# EAGLE design Netzteil_Darlington_v2_Frontpanel (EAGLE 8.6.3)
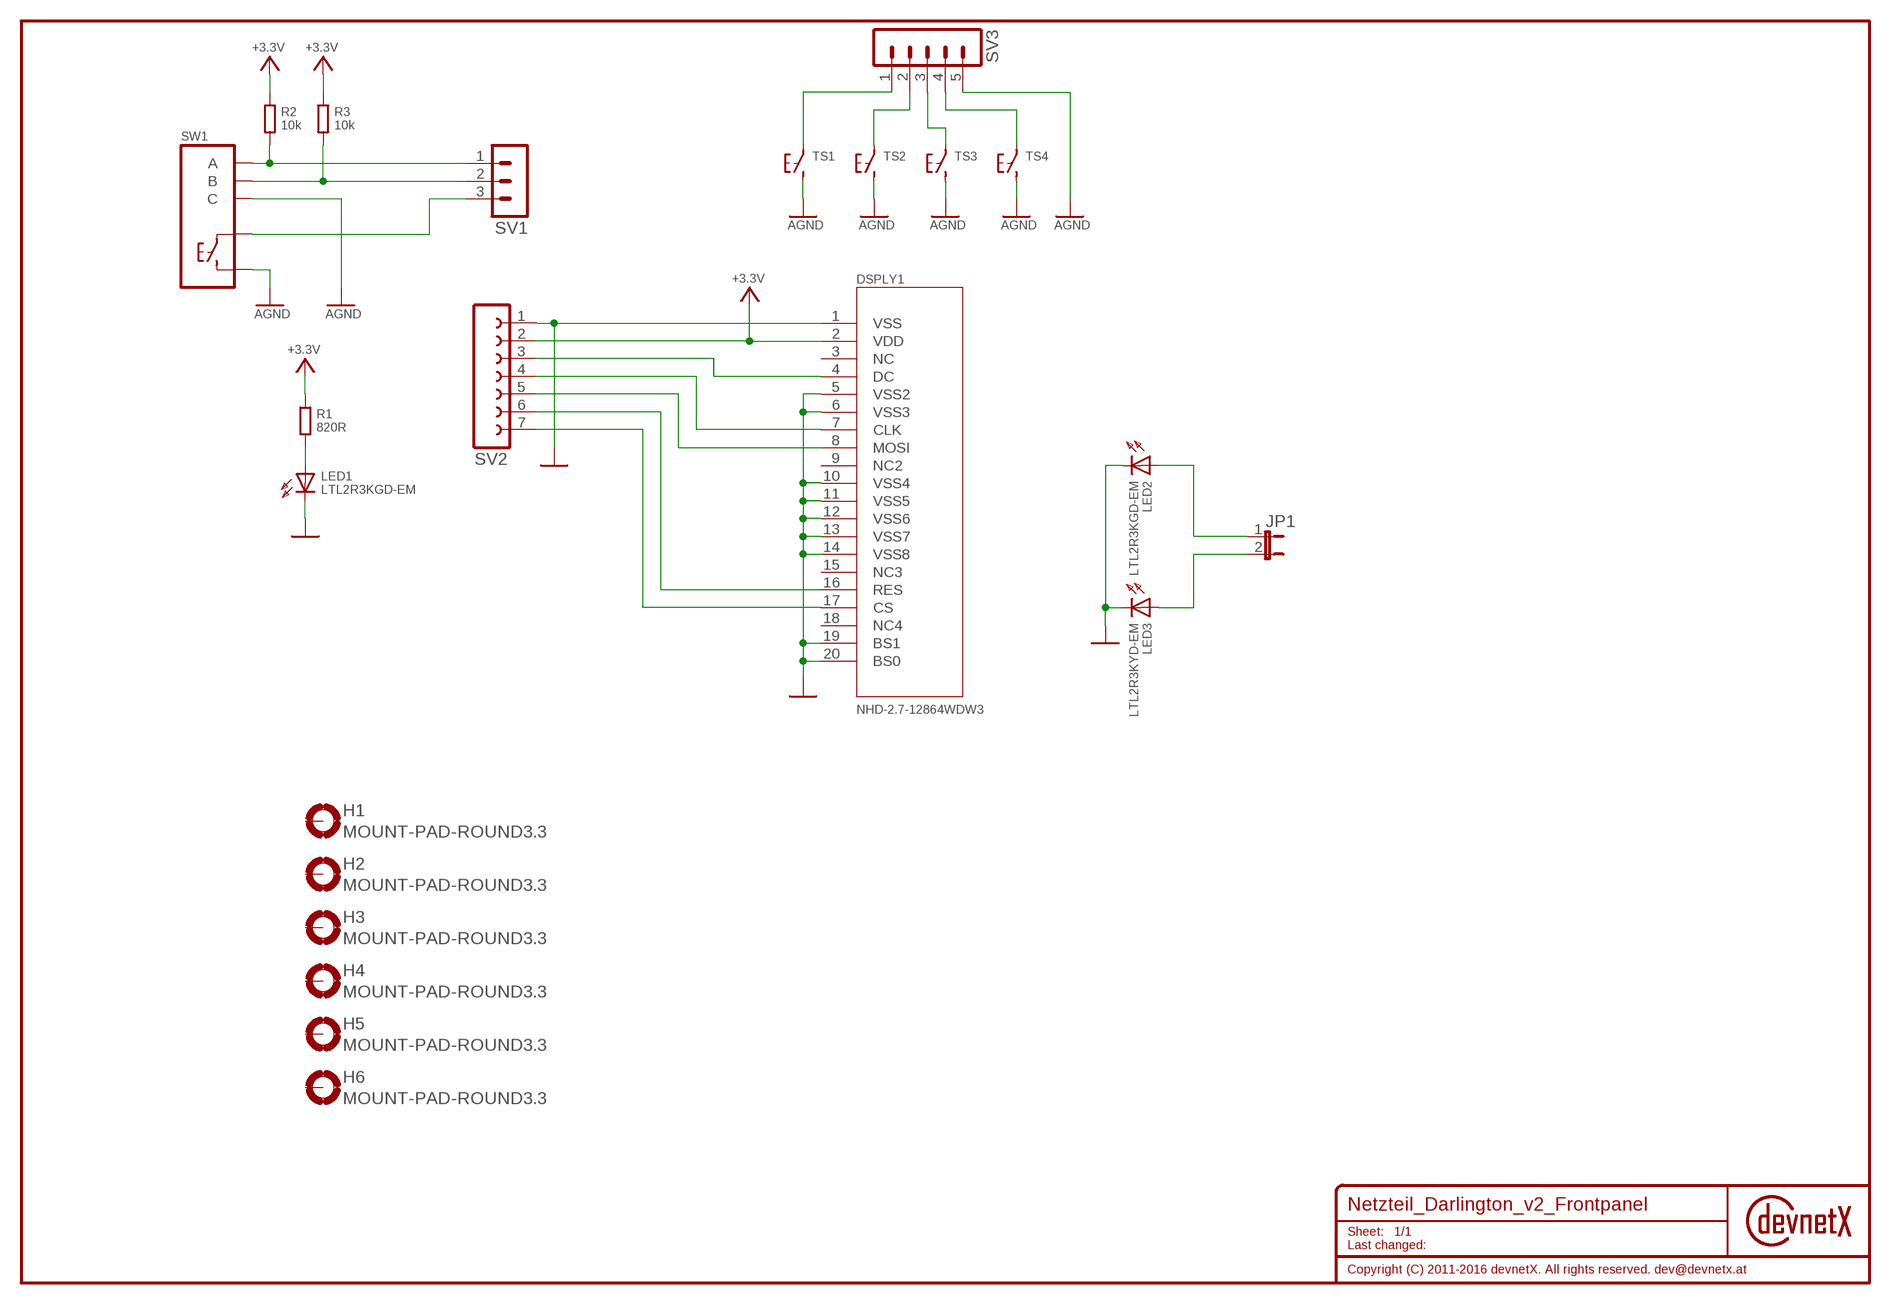
[diagram p0: schematic, sheet 1]

## Parts
DNX-NAME-1  DOC-R1.27  [DRAWINGNAME-1.27]
DSPLY1  NHD-2.7-12864WDW3  [NHD-2.7-12864WDW3]
H1  MOUNT-PAD-ROUND3.3  [3,3-PAD]
H2  MOUNT-PAD-ROUND3.3  [3,3-PAD]
H3  MOUNT-PAD-ROUND3.3  [3,3-PAD]
H4  MOUNT-PAD-ROUND3.3  [3,3-PAD]
H5  MOUNT-PAD-ROUND3.3  [3,3-PAD]
H6  MOUNT-PAD-ROUND3.3  [3,3-PAD]
JP1  JP1E  [JP1]
LED1  LTL2R3KGD-EM  LEDLED5MM  [LED5MM]
LED2  LTL2R3KGD-EM  LEDLED5MM  [LED5MM]
LED3  LTL2R3KYD-EM  LEDLED5MM  [LED5MM]
R1  820R  R-SMD0805  [C0805K]
R2  10k  R-SMD0805  [C0805K]
R3  10k  R-SMD0805  [C0805K]
SV1  MA03-1  [MA03-1]
SV2  FE07-1  [FE07]
SV3  MA05-1  [MA05-1]
SW1  EC12E-SW  [EC12E-SW]
TS1  TS1B3F-10XX  [B3F-10XX]
TS2  TS1B3F-10XX  [B3F-10XX]
TS3  TS1B3F-10XX  [B3F-10XX]
TS4  TS1B3F-10XX  [B3F-10XX]

## Nets
+3.3V: DSPLY1.2(VDD) R1.1 R2.1 R3.1 SV2.2
AGND: SV3.5 SW1.2 SW1.C TS1.3 TS2.3 TS3.3 TS4.3
N$1: JP1.1 LED2.A
N$2: JP1.2 LED3.A
N$3: DSPLY1.4(DC) SV2.3
N$5: SV3.1 TS1.1
N$6: R2.2 SV1.1 SW1.A
N$7: DSPLY1.7(CLK) SV2.4
N$8: DSPLY1.8(MOSI) SV2.5
N$10: R3.2 SV1.2 SW1.B
N$11: SV1.3 SW1.1
N$12: SV3.2 TS2.1
N$13: SV3.3 TS3.1
N$14: SV3.4 TS4.1
N$16: DSPLY1.16(RES) SV2.6
N$17: DSPLY1.17(CS) SV2.7
N$21: LED1.A R1.2
VSS: DSPLY1.1(VSS) DSPLY1.5(VSS2) DSPLY1.6(VSS3) DSPLY1.10(VSS4) DSPLY1.11(VSS5) DSPLY1.12(VSS6) DSPLY1.13(VSS7) DSPLY1.14(VSS8) DSPLY1.19(BS1) DSPLY1.20(BS0) LED1.C LED2.C LED3.C SV2.1
Unconnected: DSPLY1.3(NC) DSPLY1.9(NC2) DSPLY1.15(NC3) DSPLY1.18(NC4) H1.B3,3(MOUNT) H2.B3,3(MOUNT) H3.B3,3(MOUNT) H4.B3,3(MOUNT) H5.B3,3(MOUNT) H6.B3,3(MOUNT)

## Library data of the parts
DNX-NAME-1 = devnetx:DOC-R: devnetX Document Right
DSPLY1 = neumluc:NHD-2.7-12864WDW3
H1-H6 = holes:MOUNT-PAD-ROUND: MOUNTING PAD, round
JP1 = jumper:JP1E: JUMPER
LED1-LED3 = goujine:LED: LED
R1-R3 = neumluc:R-SMD: R SMD
SV1 = con-lstb:MA03-1: PIN HEADER; OC_FARNELL: unknown; OC_NEWARK: unknown
SV2 = con-lsta:FE07-1: FEMALE HEADER; OC_FARNELL: unknown; OC_NEWARK: unknown
SV3 = con-lstb:MA05-1: PIN HEADER; OC_FARNELL: unknown; OC_NEWARK: unknown
SW1 = goujine:EC12E-SW: ALPS ENCODER EC12-E with switch
TS1-TS4 = goujine:TS1

## Board
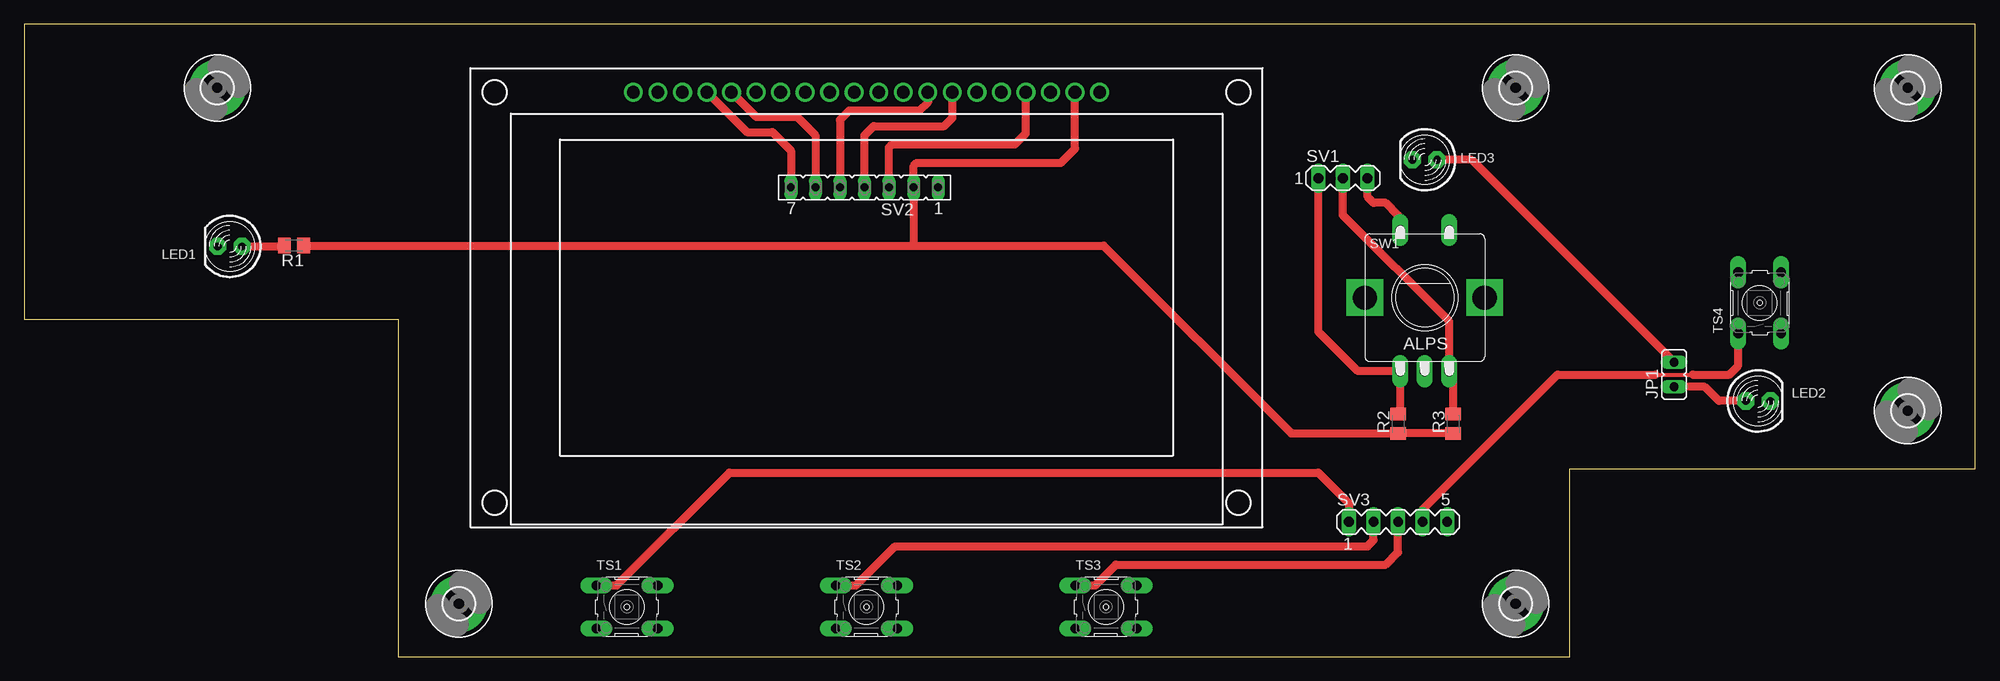
[diagram p1: board, top side]
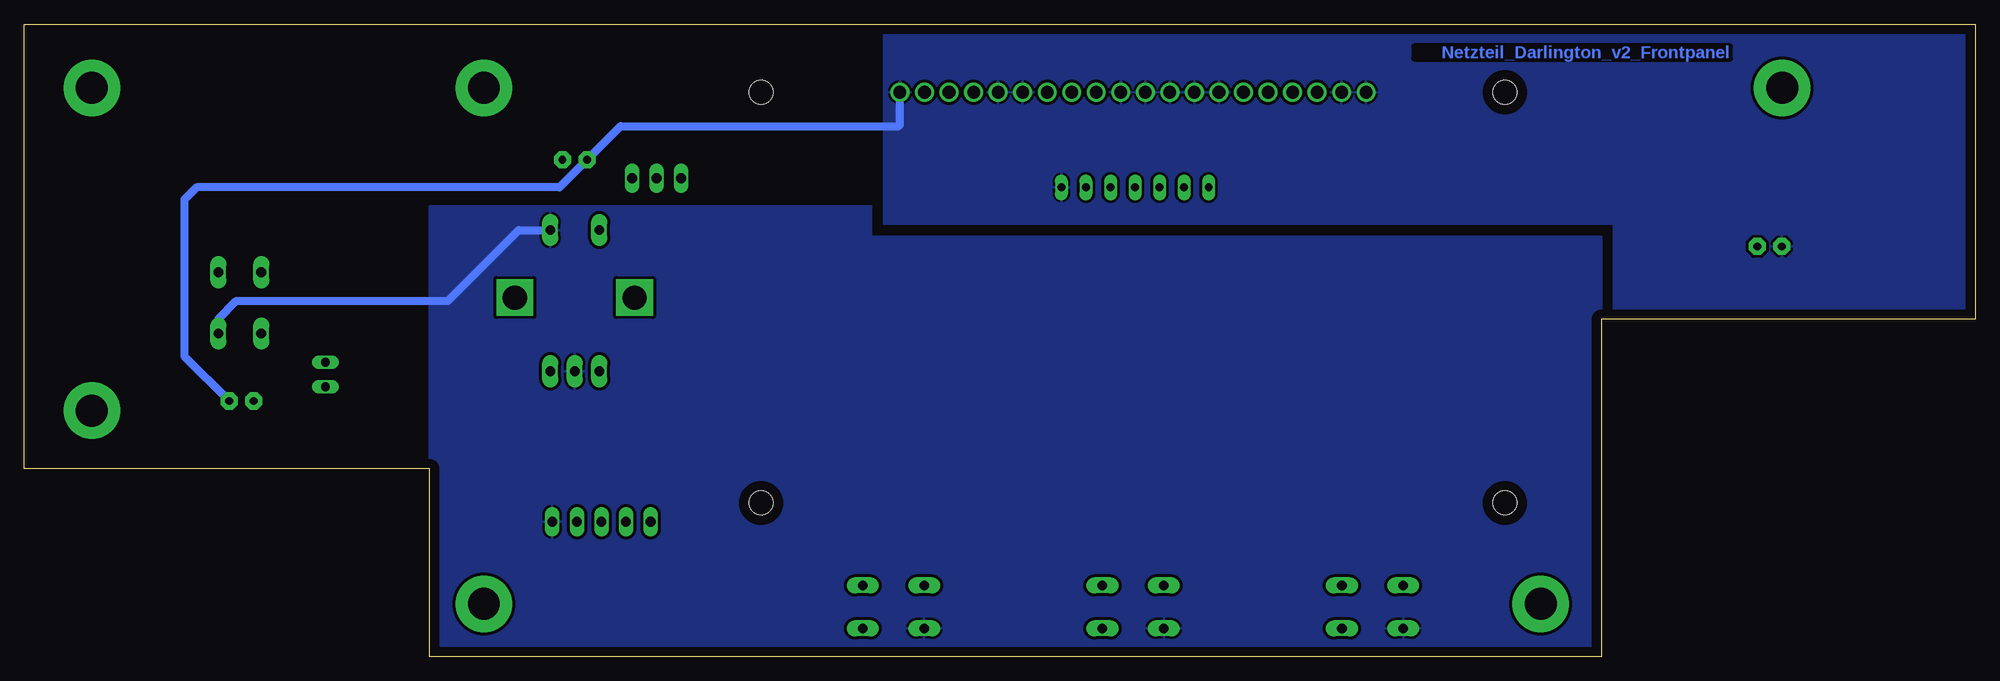
[diagram p2: board, bottom side, seen from below]

Size 202 x 65.47 mm. Coordinates in mm from the lower left corner, seen from the top.
Outline: 38.73,0 160,0 160,19.48 202,19.48 202,65.47 0,65.47 0,34.92 38.73,34.92 38.73,0
Copper layers (1*16): Top 0.035mm / dielectric 1.5mm / Bottom 0.035mm
Design rules "default": minimum track width 6mil, minimum drill 0.35mm, track to track 6mil, track to pad 6mil, pad to pad 6mil, via to via 6mil, smd to smd 6mil, copper to edge 40mil, drill to drill 6mil, minimum pad ring 10mil, minimum via ring 8mil, stop-mask expansion 4mil, vias tented up to drill 0mil, thermal gap 10mil

### Footprints (pad centres in the part's own frame; a part is rotated, then mirrored left to right if it is on the bottom)
NHD-2.7-12864WDW3 = drill 1.3 pad 1.93: 1 24.13,21.25; 2 21.59,21.25; 3 19.05,21.25; 4 16.51,21.25; 5 13.97,21.25; 6 11.43,21.25; 7 8.89,21.25; 8 6.35,21.25; 9 3.81,21.25; 10 1.27,21.25; 11 -1.27,21.25; 12 -3.81,21.25; 13 -6.35,21.25; 14 -8.89,21.25; 15 -11.43,21.25; 16 -13.97,21.25; 17 -16.51,21.25; 18 -19.05,21.25; 19 -21.59,21.25; 20 -24.13,21.25 | hole 2.5: -38.5,21.25; -38.5,-21.25; 38.5,-21.25; 38.5,21.25
3,3-PAD = drill 3.3 pad 5.842: B3,3 0,0
JP1 = drill 0.914 long: 1 0,-1.27; 2 0,1.27
LED5MM = drill 0.8 pad 1.778 octagon: A -1.27,0; C 1.27,0
C0805K = smd 1.3 x 1.6: 1 -1,0; 2 1,0
MA03-1 = drill 1.016 long: 1 -2.54,0; 2 0,0; 3 2.54,0
FE07 = drill 0.813 long: 1 -7.62,0; 2 -5.08,0; 3 -2.54,0; 4 0,0; 5 2.54,0; 6 5.08,0; 7 7.62,0
MA05-1 = drill 1.016 long: 1 -5.08,0; 2 -2.54,0; 3 0,0; 4 2.54,0; 5 5.08,0
EC12E-SW = drill 1 pad 1.676 long: 1 -2.54,6.985; 2 2.54,6.985; A -2.54,-7.62; B 2.54,-7.62; C 0,-7.62 | drill 2.5 pad 3.81 square: MOUNT1 -6.2,0; MOUNT2 6.2,0
B3F-10XX = drill 1 pad 1.676 long: 1 -3.175,1.905; 2 3.175,1.905; 3 -3.175,-2.54; 4 3.175,-2.54

### Placement (x,y rotation side)
DNX-NAME-1  25.4,63.18 180 top
DSPLY1  87.2,37.17 0 top
H1  20,58.88 0 top
H2  45,5.47 0 top
H3  154.4,5.47 0 top
H4  154.4,58.88 0 top
H5  195,58.88 0 top
H6  195,25.48 0 top
JP1  170.81,29.21 0 top
LED1  21.3,42.48 180 top
LED2  179.5,26.48 0 top
LED3  145,51.44 180 top
R1  27.94,42.55 180 top
R2  142.24,24.13 90 top
R3  147.96,24.13 90 top
SV1  136.53,49.53 0 top
SV2  87,48.58 180 top
SV3  142.24,13.97 0 top
SW1  145,37.17 0 top
TS1  62.4,5.47 0 top
TS2  87.2,5.47 0 top
TS3  112,5.47 0 top
TS4  179.36,36.62 90 top

### Tracks (layer width: path | path; a pad name or v marks a point on that pad's centre or on a via)
+3.3V
  Top 0.813: R3.1 R2.1 131.18,23.13 111.76,42.55 92.08,42.55 | R1.1 92.08,42.55 | DSPLY1.2 108.79,52.59 107.31,51.12 92.39,51.12 92.08,50.8 SV2.2 92.08,42.55
AGND
  Bottom 0.813: TS4.3 181.9,34.95 180.02,36.83 158.12,36.83 150.78,44.16 SW1.2
  pour Bottom (isolate 0.305): 38.73,0 160.02,0 160.02,46.67 114.3,46.67 114.3,43.5 38.73,43.5
N$1
  Top 0.813: LED2.A 175.46,26.48 173.99,27.94 JP1.1
N$2
  Top 0.813: LED3.A 149.86,51.44 JP1.2
N$3
  Top 0.813: SV2.3 89.53,52.7 89.85,53.02 102.55,53.02 103.71,54.18 DSPLY1.4
N$5
  Top 0.813: TS1.1 61.35,7.38 73.03,19.05 133.99,19.05 137.16,15.88 SV3.1
N$6
  Top 0.813: R2.2 142.46,25.35 SW1.A 138.09,29.55 133.99,33.66 SV1.1
N$7
  Top 0.813: SV2.4 87,53.98 87.95,54.93 95.25,54.93 96.09,55.77 DSPLY1.7
N$8
  Top 0.813: DSPLY1.8 93.55,57.35 92.71,56.52 85.41,56.52 84.45,55.56 SV2.5
N$10
  Top 0.813: R3.2 147.96,29.14 SW1.B 147.54,34.7 136.53,45.72 SV1.2
N$11
  Top 0.813: SW1.1 142.24,44.38 142.24,45.72 140.97,46.99 139.7,46.99 139.06,47.62 SV1.3
N$12
  Top 0.813: TS2.1 86.12,7.38 90.17,11.43 139.06,11.43 139.7,12.06 SV3.2
N$13
  Top 0.813: TS3.1 110.89,7.38 113.03,9.53 140.97,9.53 142.24,10.79 SV3.3
N$14
  Top 0.406: 168.91,29.21 172.72,29.21
  Top 0.813: SV3.4 144.78,15.24 158.75,29.21 168.91,29.21 | 172.72,29.21 176.53,29.21 177.46,30.14 TS4.1
N$16
  Top 0.813: DSPLY1.16 75.78,55.88 80.01,55.88 81.92,53.98 SV2.6
N$17
  Top 0.813: DSPLY1.17 74.82,54.29 77.47,54.29 79.38,52.39 SV2.7
N$21
  Top 0.813: LED1.A 26.87,42.48 R1.2
VSS
  Bottom 0.813: DSPLY1.1 111.33,55.04 111.44,54.93 140.24,54.93 LED3.C 146.59,48.58 184.15,48.58 185.42,47.31 185.42,31.12 LED2.C
  pour Bottom (isolate 0.305): 0,65.41 113.03,65.41 113.03,44.77 37.47,44.77 37.47,34.92 0,34.92

### Text on the board
Notes: Power LED | Output ON LED